# Altium project Sensor_Box_CAN_Shutter_CTRL.PrjPCB
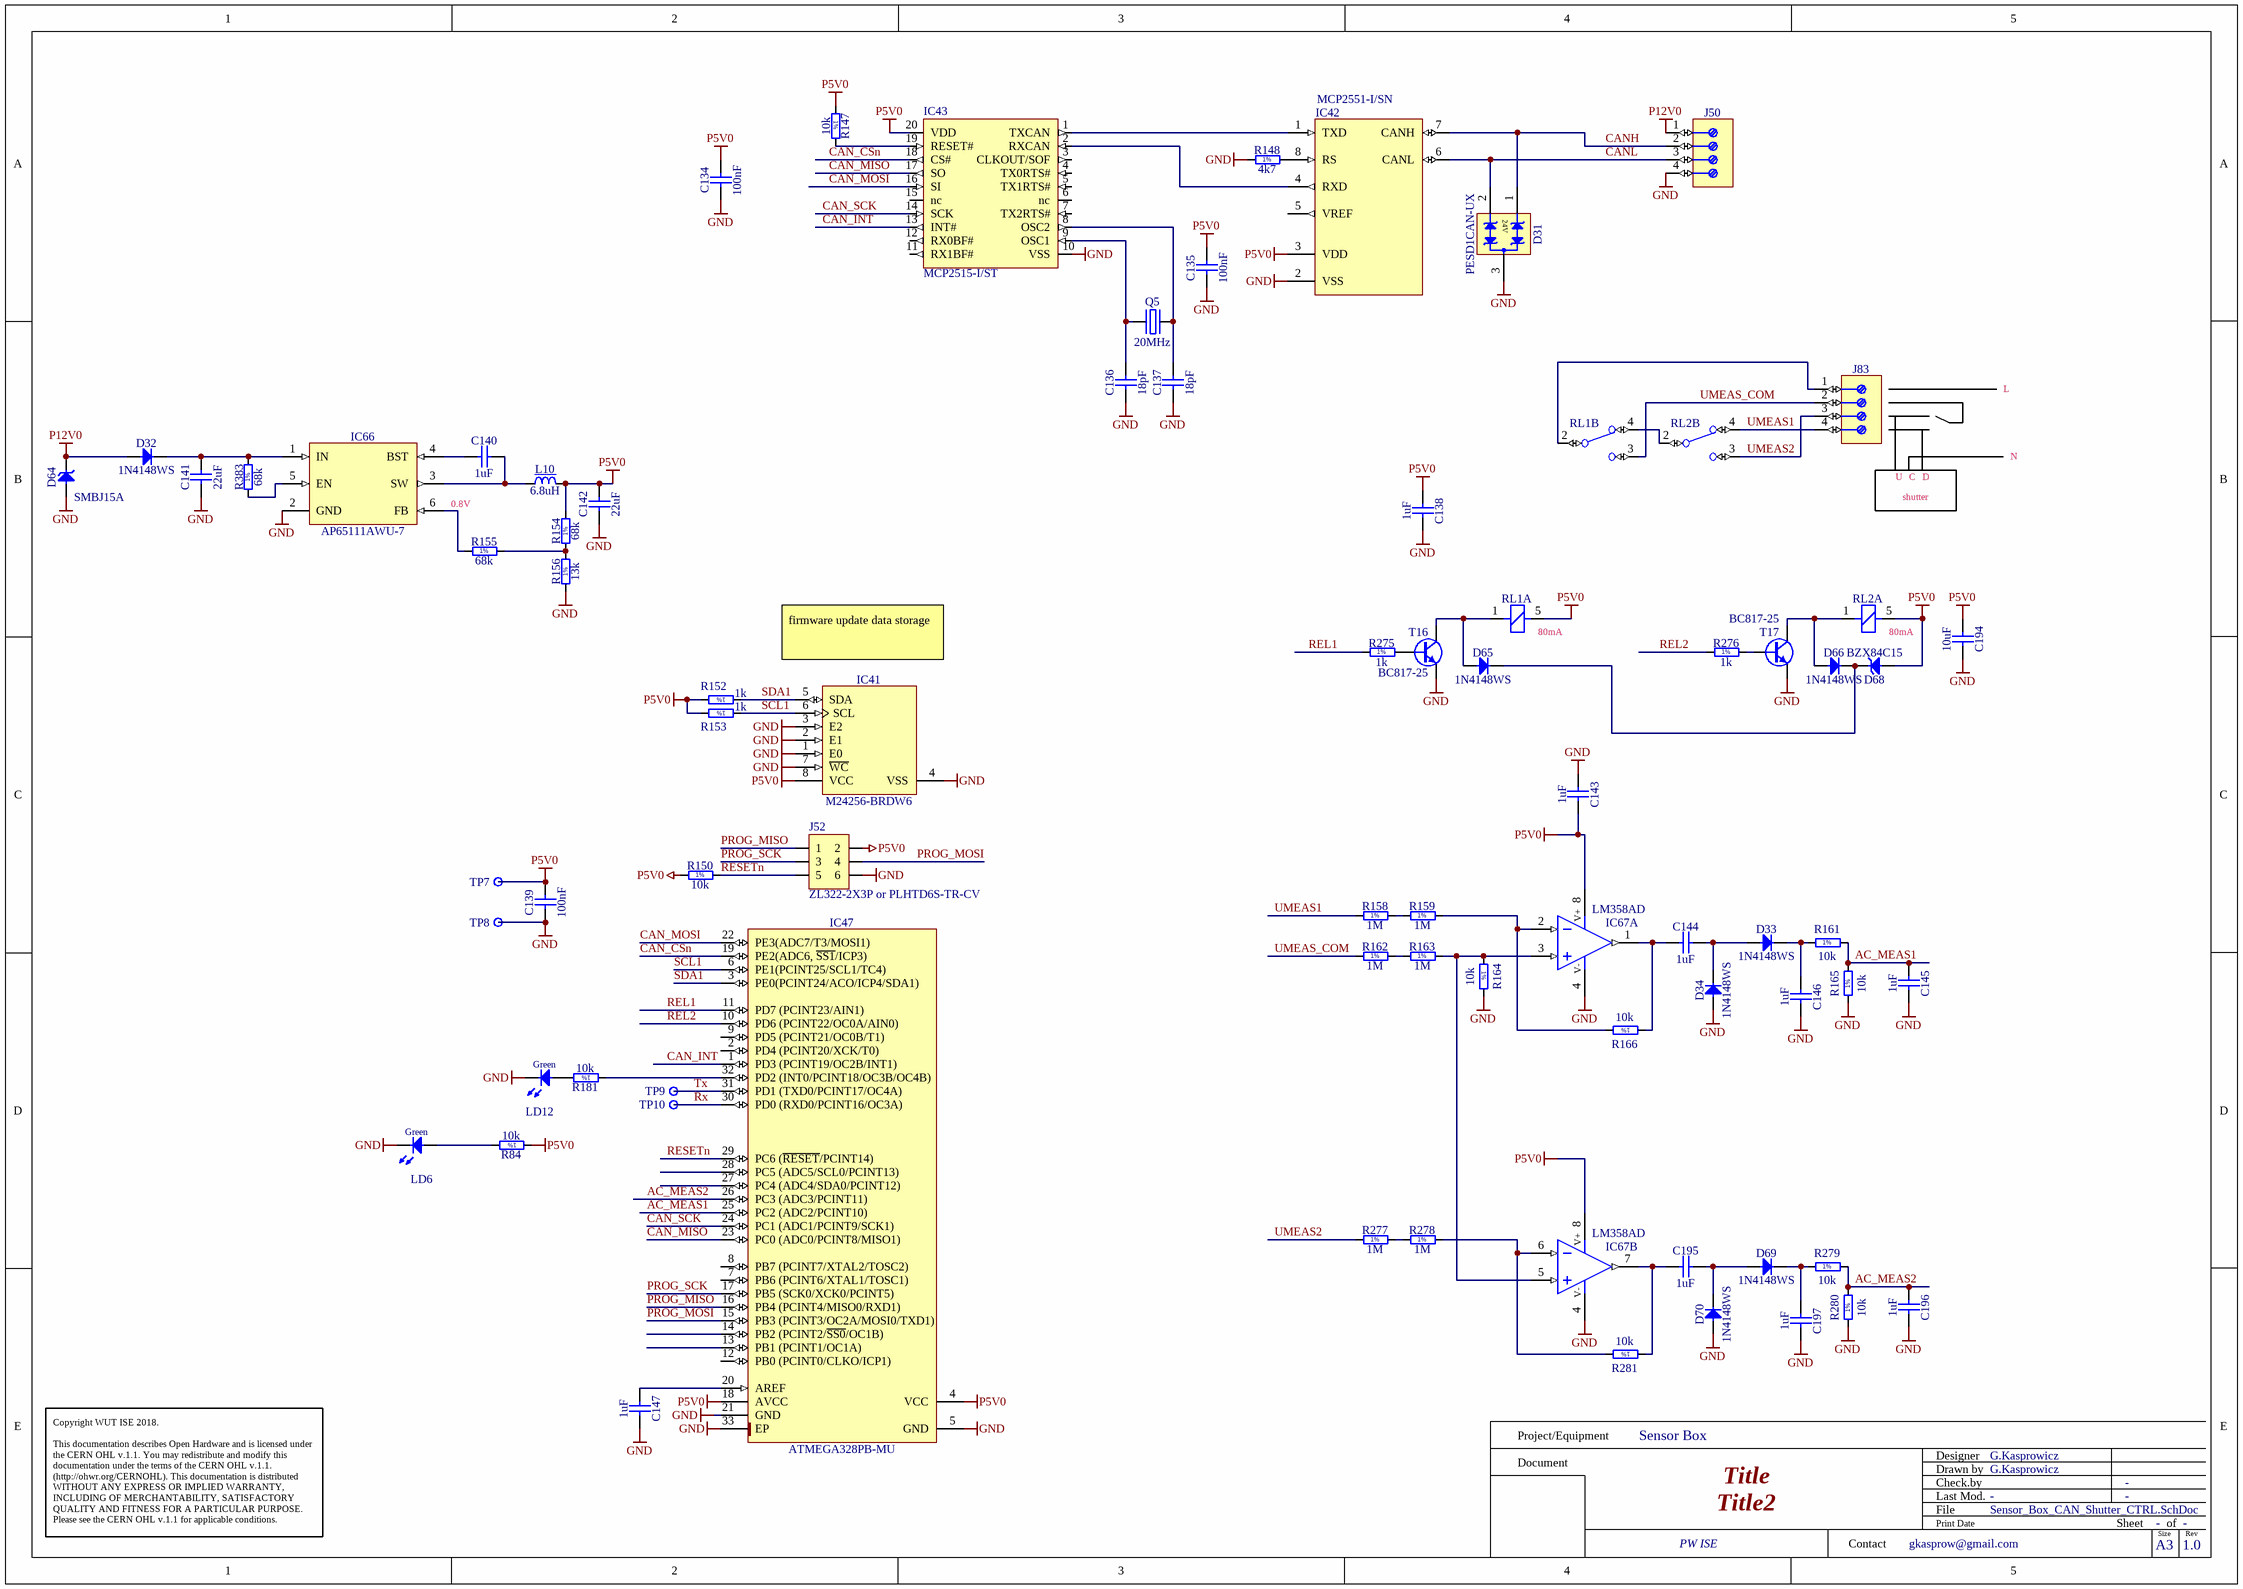
[diagram p0: Sensor_Box_CAN_Shutter_CTRL.SchDoc]
1 sheet, 75 parts. Net scope: global (net labels, ports and power ports of the same name join across sheets).
Board file: Sensor_Box_CAN_Shutter_CTRL.PCBDOC

## Sheet Sensor_Box_CAN_Shutter_CTRL.SchDoc: Title
size 420 x 297 mm; Author: G.Kasprowicz; CompanyName: WUT ISE; DrawnBy: G.Kasprowicz; Organization: WUT ISE; Address1: PW ISE; Address2: Nowowiejska 15/19 00-665 Warsaw; Address3: gkasprow@gmail.com; Revision: 1.0; SheetNumber: -; SheetTotal: -; ModifiedBy: -; CheckedDate: -; Title2: Title2; DivGrp: WUT ISE; Designer: G.Kasprowicz; ModifiedDate: -; ProjectName: Sensor Box

### Parts
C134  100nF  [CAPC1005X55N]
C135  100nF  [CAPC1005X55N]
C136  18pF  [CAPC1005X55N]
C137  18pF  [CAPC1005X55N]
C138  1uF  [CAPC1005X55N]
C139  100nF  [CAPC1005X55N]
C140  1uF  [CAPC1005X55N]
C141  22uF  [CAPC1709X100N]
C142  22uF  [CAPC1709X100N]
C143  1uF  [CAPC1005X55N]
C144  1uF  [CAPC1005X55N]
C145  1uF  [CAPC1005X55N]
C146  1uF  [CAPC1005X55N]
C147  1uF  [CAPC1005X55N]
C194  10uF  [CAPC2012X135N]
C195  1uF  [CAPC1005X55N]
C196  1uF  [CAPC1005X55N]
C197  1uF  [CAPC1005X55N]
D31  PESD1CAN-UX  [SOT95P237X112-3N]
D32  1N4148WS  [SODFL2512X100N]
D33  1N4148WS  [SODFL2512X100N]
D34  1N4148WS  [SODFL2512X100N]
D64  SMBJ15A  [DIOM5336X265N]
D65  1N4148WS  [SODFL2512X100N]
D66  1N4148WS  [SODFL2512X100N]
D68  BZX84C15  [SOT95P240X130-3N]
D69  1N4148WS  [SODFL2512X100N]
D70  1N4148WS  [SODFL2512X100N]
IC41  M24256-BRDW6  [SOP65P640X120-8N]
IC42  MCP2551-I/SN  [SOIC127P600X175-8N]
IC43  MCP2515-I/ST  [SOP65P640X110-20N]
IC47  ATMEGA328PB-MU  [QFN50P500X500X100-33N-S325]
IC66  AP65111AWU-7  [SOT95P280X100-6N]
IC67  LM358AD  [SOIC127P600X175-8N]  (parts A,B of 2)
J50  (no value)  [PHOENIX_1725672]
J52  ZL322-2X3P or PLHTD6S-TR-CV  [ZL322-2X3P]
J83  (no value)  [TYCO_282836-4]
L10  6.8uH  [IND_WALSIN_WLPN3030]
LD6  Green  [LED_KINGBRIGHT_KPH-1608CGCK]
LD12  Green  [LED_KINGBRIGHT_KPH-1608CGCK]
Q5  20MHz  [XTAL1160X490X430]
R84  10k  [RESC1005X40N]
R147  10k  [RESC1005X40N]
R148  4k7  [RESC1005X40N]
R150  10k  [RESC1005X40N]
R152  1k  [RESC1005X40N]
R153  1k  [RESC1005X40N]
R154  68k  [RESC1005X40N]
R155  68k  [RESC1005X40N]
R156  13k  [RESC1005X40N]
R158  1M  [RESC3216X65N]
R159  1M  [RESC3216X65N]
R161  10k  [RESC1005X40N]
R162  1M  [RESC3216X65N]
R163  1M  [RESC3216X65N]
R164  10k  [RESC1005X40N]
R165  10k  [RESC1005X40N]
R166  10k  [RESC1005X40N]
R181  10k  [RESC1005X40N]
R275  1k  [RESC1005X40N]
R276  1k  [RESC1005X40N]
R277  1M  [RESC3216X65N]
R278  1M  [RESC3216X65N]
R279  10k  [RESC1005X40N]
R280  10k  [RESC1005X40N]
R281  10k  [RESC1005X40N]
R383  68k  [RESC1005X40N]
RL1  REL_OMRON_G5Q-1  [REL_OMRON_G5Q-1]  (value not drawn)  (parts A,B of 2)
RL2  REL_OMRON_G5Q-1  [REL_OMRON_G5Q-1]  (value not drawn)  (parts A,B of 2)
T16  BC817-25  [SOT95P230X110-3N]
T17  BC817-25  [SOT95P230X110-3N]
TP7  Test Point  [TPS127]  (value not drawn)
TP8  Test Point  [TPS127]  (value not drawn)
TP9  Test Point  [TPS127]  (value not drawn)
TP10  Test Point  [TPS127]  (value not drawn)

### Nets
GND: C134.1 C135.1 C136.1 C137.1 C138.2 C139.1 C141.1 C142.1 C143.1 C145.2 C146.2 C147.2 C194.2 C196.2 C197.2 D31.3(GND) D34.2(A) D64.2(A) D70.2(A) IC41.1(E0) IC41.2(E1) IC41.3(E2) IC41.4(VSS) IC41.7(~{WC}) IC42.2(VSS) IC43.10(VSS) IC47.5(GND) IC47.21(GND) IC47.33(EP) IC66.2(GND) IC67.4(V-) J50.4 J52.6 LD6.1(C) LD12.1(C) R148.1 R156.1 R164.2 R165.1 R280.1 T16.2(E) T17.2(E) TP8.1
P5V0: C134.2 C135.2 C138.1 C139.2 C142.2 C143.2 C194.1 D68.1(A) IC41.8(VCC) IC42.3(VDD) IC43.20(VDD) IC47.4(VCC) IC47.18(AVCC) IC67.8(V+) J52.2 L10.2 R84.1 R147.1 R150.1 R152.2 R153.2 R154.2 RL1.5 RL2.5 TP7.1
P12V0: D32.2(A) D64.1(C) J50.1
AC_MEAS1: C145.1 IC47.25(PC2_(ADC2/PCINT10)) R161.2 R165.2
AC_MEAS2: C196.1 IC47.26(PC3_(ADC3/PCINT11)) R279.2 R280.2
CAN_CSn: IC43.18(CS#) IC47.19(PE2(ADC6,_~{SS1}/ICP3))
CAN_INT: IC43.13(INT#) IC47.1(PD3_(PCINT19/OC2B/INT1))
CAN_MISO: IC43.17(SO) IC47.23(PC0_(ADC0/PCINT8/MISO1))
CAN_MOSI: IC43.16(SI) IC47.22(PE3(ADC7/T3/MOSI1))
CAN_SCK: IC43.14(SCK) IC47.24(PC1_(ADC1/PCINT9/SCK1))
CANH: D31.1(I/O1) IC42.7(CANH) J50.2
CANL: D31.2(I/O2) IC42.6(CANL) J50.3
PROG_MISO: IC47.16(PB4_(PCINT4/MISO0/RXD1)) J52.1
PROG_MOSI: IC47.15(PB3_(PCINT3/OC2A/MOSI0/TXD1)) J52.4
PROG_SCK: IC47.17(PB5_(SCK0/XCK0/PCINT5)) J52.3
REL1: IC47.11(PD7_(PCINT23/AIN1)) R275.1
REL2: IC47.10(PD6_(PCINT22/OC0A/AIN0)) R276.1
RESETn: IC47.29(PC6_(~{RESET}/PCINT14)) J52.5 R150.2
Rx: IC47.30(PD0_(RXD0/PCINT16/OC3A)) TP10.1
SCL1: IC41.6(SCL) IC47.6(PE1(PCINT25/SCL1/TC4)) R153.1
SDA1: IC41.5(SDA) IC47.3(PE0(PCINT24/ACO/ICP4/SDA1)) R152.1
Tx: IC47.31(PD1_(TXD0/PCINT17/OC4A)) TP9.1
UMEAS1: J83.4 R158.1 RL2.4(NC)
UMEAS2: J83.3 R277.1 RL2.3(NO)
UMEAS_COM: J83.2 R162.1 RL1.3(NO)
NetC136_2: C136.2 IC43.9(OSC1) Q5.1(OSC1)
NetC137_2: C137.2 IC43.8(OSC2) Q5.2(OSC2)
NetC140_1: C140.1 IC66.4(BST)
NetC140_2: C140.2 IC66.3(SW) L10.1
NetC141_2: C141.2 D32.1(C) IC66.1(IN) R383.2
NetC144_1: C144.1 IC67.1(OUT) R166.1
NetC144_2: C144.2 D33.2(A) D34.1(C)
NetC146_1: C146.1 D33.1(C) R161.1
NetC147_1: C147.1 IC47.20(AREF)
NetC195_1: C195.1 IC67.7(OUT) R281.1
NetC195_2: C195.2 D69.2(A) D70.1(C)
NetC197_1: C197.1 D69.1(C) R279.1
NetD65_1: D65.1(C) D66.1(C) D68.3(C)
NetD65_2: D65.2(A) RL1.1 T16.3(C)
NetD66_2: D66.2(A) RL2.1 T17.3(C)
NetIC42_1: IC42.1(TXD) IC43.1(TXCAN)
NetIC42_4: IC42.4(RXD) IC43.2(RXCAN)
NetIC42_8: IC42.8(RS) R148.2
NetIC43_19: IC43.19(RESET#) R147.2
NetIC47_32: IC47.32(PD2_(INT0/PCINT18/OC3B/OC4B)) R181.1
NetIC66_5: IC66.5(EN) R383.1
NetIC66_6: IC66.6(FB) R155.1
NetIC67_2: IC67.2(IN-) R159.2 R166.2
NetIC67_3: IC67.3(IN+) IC67.5(IN+) R163.2 R164.1
NetIC67_6: IC67.6(IN-) R278.2 R281.2
NetJ83_1: J83.1 RL1.2(C)
NetLD6_2: LD6.2(A) R84.2
NetLD12_2: LD12.2(A) R181.2
NetR154_1: R154.1 R155.2 R156.2
NetR158_2: R158.2 R159.1
NetR162_2: R162.2 R163.1
NetR275_2: R275.2 T16.1(B)
NetR276_2: R276.2 T17.1(B)
NetR277_2: R277.2 R278.1
NetRL1_4: RL1.4(NC) RL2.2(C)

Not connected (* = marked no-connect by the designer): IC42 5(VREF); IC43 3(CLKOUT/SOF) 4(TX0RTS#) 5(TX1RTS#) 6(nc) 7(TX2RTS#) 11(RX1BF#) 12(RX0BF#) 15(nc); IC47 2(PD4_(PCINT20/XCK/T0)) 7(PB6_(PCINT6/XTAL1/TOSC1)) 8(PB7_(PCINT7/XTAL2/TOSC2)) 9(PD5_(PCINT21/OC0B/T1)) 12(PB0_(PCINT0/CLKO/ICP1)) 13(PB1_(PCINT1/OC1A)) 14(PB2_(PCINT2/~{SS0}/OC1B)) 27(PC4_(ADC4/SDA0/PCINT12)) 28(PC5_(ADC5/SCL0/PCINT13))

### Notes on the sheet
- L
- N
- 0.8V
- U
- shutter
- C
- D
- firmware update data storage
- (near RL1) 80mA
- (near RL2) 80mA
- Project/Equipment
- Document
- Designer
- Drawn by
- Check.by
- Copyright WUT ISE 2018.
  This documentation describes Open Hardware and is licensed under the CERN OHL v.1.1. You may redistribute and modify this documentation under the terms of the CERN OHL v.1.1. (http://ohwr.org/CERNOHL). This documentation is distributed WITHOUT ANY EXPRESS OR IMPLIED WARRANTY, INCLUDING OF MERCHANTABILITY, SATISFACTORY QUALITY AND FITNESS FOR A PARTICULAR PURPOSE. Please see the CERN OHL v.1.1 for applicable conditions.
- Contact
- File
- Last Mod.
- Print Date
- Sheet
- Size
- A3
- of
- Rev
- (in symbol R0402_1K_1%_0.0625W_100PPM) 1%
- (in symbol R0402_4K7_1%_0.0625W_100PPM) 1%
- (in symbol R0402_10K_1%_0.0625W_100PPM) 1%
- (in symbol R0402_13K_1%_0.0625W_100PPM) 1%
- (in symbol R0402_68K_1%_0.0625W_100PPM) 1%
- (in symbol R1206_1M_1%_0.25W_100PPM) 1%

### Library data of the parts
C134 C135 C139 = CC0402_100NF_16V_10%_X5R: Non-polarised capacitor; Part Description: SMD Multilayer Chip Ceramic Capacitor; Manufacturer: GENERIC; Manufacturer1 Part Number: GRM155R61C104KA88D; Voltage: 16V; TC: X5R; Tolerance: ±10%; Part Number: CC0402_100NF_16V_10%_X5R; Component Kind: Standard; Component Type: Standard; Pin Count: 2; Value: 100nF; Status: None; Manufacturer Part Number: CC0402_100NF_16V_10%_X5R; Case: 0402; Mounted: Yes; Socket: No; SMD: Yes; Sense: No; Manufacturer1 Example: MURATA; Manufacturer1 ComponentHeight: 0.55mm; HelpURL: \\cern.ch\dfs\Applications\Altium\Datasheets\CC0402_X5R_MURATA_GRM.pdf; Author: CERN DEM JLC; CreateDate: 10.12.2013; LatestRevisionDate: 10.12.2013
C136 C137 = CC0402_18PF_50V_5%_C0G: Non-polarised capacitor; Part Description: SMD Multilayer Chip Ceramic Capacitor; Manufacturer: GENERIC; Manufacturer1 Part Number: C0402C180J5GACTU; Voltage: 50V; TC: C0G/NP0; Tolerance: ±5%; Part Number: CC0402_18PF_50V_5%_C0G; Component Kind: Standard; Component Type: Standard; Pin Count: 2; Value: 18pF; Status: Preferred; Manufacturer Part Number: CC0402_18PF_50V_5%_C0G; Case: 0402; Mounted: Yes; Socket: No; SMD: Yes; Sense: No; Manufacturer1 Example: KEMET; Manufacturer1 ComponentHeight: 0.55mm; HelpURL: \\cern.ch\dfs\Applications\Altium\Datasheets\CC0805_C0G_KEMET_(Commercial Grade).pdf; Author: CERN DEM JLC; CreateDate: 04.10.2016; LatestRevisionDate: 04.10.2016
C138 C140 C143-C147 C195-C197 = CC0402_1UF_16V_10%_X5R: Non-polarised capacitor; Part Description: SMD Multilayer Chip Ceramic Capacitor; Manufacturer: GENERIC; Manufacturer1 Part Number: C1005X5R1C105KT; Voltage: 16V; TC: X5R; Tolerance: ±10%; Part Number: CC0402_1UF_16V_10%_X5R; Component Kind: Standard; Component Type: Standard; Pin Count: 2; Value: 1uF; Status: Preferred; Manufacturer Part Number: CC0402_1UF_16V_10%_X5R; Case: 0402; Mounted: Yes; Socket: No; SMD: Yes; Sense: No; Manufacturer1 Example: TDK; Manufacturer1 ComponentHeight: 0.55mm; HelpURL: \\cern.ch\dfs\Applications\Altium\Datasheets\CC0402_X5R_TDK_C.pdf; Author: CERN DEM JLC; CreateDate: 25.10.2012; LatestRevisionDate: 25.10.2012
C141 C142 = CC0603_22UF_6.3V_20%_X5R: Non-polarised capacitor; Part Description: SMD Multilayer Chip Ceramic Capacitor; Manufacturer: GENERIC; Manufacturer1 Part Number: C1608X5R0J226M080AC; Voltage: 6.3V; TC: X5R; Tolerance: ±20%; Part Number: CC0603_22UF_6.3V_20%_X5R; Component Kind: Standard; Component Type: Standard; Pin Count: 2; Value: 22uF; Status: None; Manufacturer Part Number: CC0603_22UF_6.3V_20%_X5R; Case: 0603; Mounted: Yes; Socket: No; SMD: Yes; Sense: No; Manufacturer1 Example: TDK; Manufacturer1 ComponentHeight: 1mm; HelpURL: \\cern.ch\dfs\Applications\Altium\Datasheets\CC0603_X5R_TDK_C.pdf; Author: CERN DEM JLC; CreateDate: 16.12.2013; LatestRevisionDate: 13.09.2016
C194 = CC0805_10UF_16V_10%_X5R: Non-polarised capacitor; Part Description: SMD Multilayer Chip Ceramic Capacitor; Manufacturer: GENERIC; Manufacturer1 Part Number: C0805C106K4PAC; Voltage: 16V; TC: X5R; Tolerance: ±10%; Part Number: CC0805_10UF_16V_10%_X5R; Component Kind: Standard; Component Type: Standard; Pin Count: 2; Value: 10uF; Status: Preferred; Manufacturer Part Number: CC0805_10UF_16V_10%_X5R; Case: 0805; Mounted: Yes; Socket: No; SMD: Yes; Manufacturer1 Example: KEMET; Manufacturer1 ComponentHeight: 1.4mm; HelpURL: \\cern.ch\dfs\Applications\Altium\Datasheets\CC1206_X5R_KEMET.pdf; Author: CERN DEM JLC; CreateDate: 03.12.2007; LatestRevisionDate: 03.12.2007; Sense: No
D31 = D_TVS_PESD1CAN: TVS Diode for CAN; Manufacturer: Nexperia; Voltage: 24V; Power: 400W; PressFit: No; Bonding: No; Part Number: PESD1CAN-UX; Component Kind: Standard; Component Type: Standard; Device: PESD1CAN-UX; PackageDescription: SOT, 0.95mm, pitch; 3 pin,1.30mm W X 2.92mm L X 1.12mm H body, IPC Medium Density; Part Description: TVS Diode for CAN; Manufacturer Part Number: PESD1CAN-UX; Pin Count: 3; Case: SOT-23; Mounted: Yes; Socket: No; SMD: Yes; Sense: No; ComponentHeight: 1.12mm; HelpURL: \\cern.ch\dfs\Applications\Altium\Datasheets\SM712.TCT.pdf; Author: CERN DEM JLC; CreateDate: 03.09.2014; LatestRevisionDate: 13.01.2015
D32-D34 D65 D66 D69 D70 = 1N4148WS: Diode; Part Description: Small Signal Diodes; Manufacturer: FAIRCHILD SEMICONDUCTOR; Voltage: 75V; Power: 150mA; PressFit: No; Bonding: No; Part Number: 1N4148WS; Component Kind: Standard; Component Type: Standard; Device: 1N4148WS; PackageDescription: SODFL Diode; 1.70mm W X 1.25mm L X 1.00mm H body, IPC Medium Density; Manufacturer Part Number: 1N4148WS; Pin Count: 2; Case: SOD-323F; Mounted: Yes; Socket: No; SMD: Yes; Sense: No; ComponentHeight: 1mm; HelpURL: \\cern.ch\dfs\Applications\Altium\Datasheets\1N4148WS.pdf; Author: CERN DEM JLC; CreateDate: 12.05.2011; LatestRevisionDate: 12.05.2011
D64 = SMBJ15A: Zener Diode; Part Description: Uni-Directional Transient Voltage Suppressor Diode; Manufacturer: FAIRCHILD SEMICONDUCTOR; Voltage: 15V; Power: 600W; PressFit: No; Bonding: No; Part Number: SMBJ15A; Component Kind: Standard; Component Type: Standard; Device: SMBJ15A; PackageDescription: DO-214-AA/SMB Diode, Molded Body; 5.34mm L X 3.625mm W X 2.65mm H, IPC Medium Density; Manufacturer Part Number: SMBJ15A; Pin Count: 2; Case: DO-214AA; Mounted: Yes; Socket: No; SMD: Yes; Sense: No; ComponentHeight: 2.65mm; HelpURL: \\cern.ch\dfs\Applications\Altium\Datasheets\SMBJ.pdf; Author: CERN DEM JLC; CreateDate: 08.12.2008; LatestRevisionDate: 19.12.2011
D68 = BZX84C15: Diode Zener Anode Pin 1 Cathode Pin 3 (Pas de pin 2); Part Description: Zener Diode; Manufacturer: FAIRCHILD SEMICONDUCTOR; Voltage: 15V; Power: 350mW; PressFit: No; Bonding: No; Part Number: BZX84C15; Component Kind: Standard; Component Type: Standard; Device: BZX84C15; PackageDescription: SOT23 3-Leads, Pitch 0.95mm - Body 1.3x2.9mm, IPC Medium Density; Manufacturer Part Number: BZX84C15; Pin Count: 3; Case: SOT23-3; Mounted: Yes; Socket: No; SMD: Yes; Sense: No; ComponentHeight: 1.3mm; HelpURL: \\cern.ch\dfs\Applications\Altium\Datasheets\BZX84C15.pdf; Author: CERN DEM JLC; CreateDate: 30.11.2011; LatestRevisionDate: 30.11.2011
IC41 = MEM_M24256-BRDW6P: 256-Kbit Serial I²C Bus EEPROM; Manufacturer: ST MICROELECTRONICS; PressFit: No; Bonding: No; Part Number: M24256-BRDW6P; Component Kind: Standard; Component Type: Standard; Device: M24256-BRDW6; PackageDescription: SOP, 0.65mm pitch; 8 pin, 4.40mm W X 3.00mm L X 1.20mm H body, IPC Medium Density; Part Description: 256-Kbit Serial I²C Bus EEPROM; Manufacturer Part Number: M24256-BRDW6; Pin Count: 8; Case: TSSOP8; Mounted: Yes; Socket: No; SMD: Yes; Sense: No; ComponentHeight: 1.2mm; HelpURL: \\cern.ch\dfs\Applications\Altium\Datasheets\M24256-BRDW6P.pdf; Author: CERN DEM MR; CreateDate: 17.03.2016; LatestRevisionDate: 17.03.2016
IC42 = IFC_MCP2551: High-Speed CAN Transceiver, 8-Pin SOIC, Industrial Temperature; Manufacturer: MICROCHIP TECHNOLOGY; PressFit: No; Bonding: No; Part Number: MCP2551-I/SN; Component Kind: Standard; Component Type: Standard; Device: MCP2551-I/SN; PackageDescription: SOIC 8, Pitch 1.27mm - Body 4x5mm, IPC Medium Density; Part Description: High-Speed CAN Transceiver; Manufacturer Part Number: MCP2551-I/SN; Pin Count: 8; Case: SOIC8; Mounted: Yes; Socket: No; SMD: Yes; Sense: No; ComponentHeight: 1.75mm; Author: GK; CreateDate: 07.09.2016; LatestRevisionDate: 07.09.2016
IC43 = IFC_MCP2515_TSSOP: CAN Controller With SPI nterface; Manufacturer: Microchip; Manufacturer Part Number: MCP2515T-I/ST; Part Description: Stand-Alone CAN Controller with SPI Interface; Case: TSSOP20; Component Type: Standard; Device: MCP2515; Mounted: Yes; PackageDescription: TSSOP 20, Pitch 0.65mm - Body 4.5x6.5mm, IPC Medium Density; Part Number: MCP2515T-I/ST; Pin Count: 20; SMD: Yes
IC47 = UPC_ATMEGA328PB-MU: 8-bit AVR 20MHz Microcontroller With 32K Bytes In-System  Programmable  Flash; Part Description: 8-bit AVR Microcontroller, 32KB Flash, 1KB EEPROM, 2KB SRAM, 32-pin MLF, Industrial Grade (-40°C to 85°C); Manufacturer: ATMEL; PressFit: No; Bonding: No; Part Number: ATMEGA328PB-MU; Component Kind: Standard; Component Type: Standard; Device: ATMEGA328PB-MU; PackageDescription: QFN, (MO-220-VHHD-2) 0.50mm pitch,square; 8 pin X 8 pin, 5mm X 5mm X 1.00mm H body (w/thermal tab 3.25 X 3.25mm),  IPC Medium Density; Manufacturer Part Number: ATMEGA328PB-MU; Pin Count: 33; Case: QFN32; Mounted: Yes; Socket: No; SMD: Yes; Sense: No; ComponentHeight: 1mm; HelpURL: \\cern.ch\dfs\Applications\Altium\Datasheets\ATMEGA328P-MU.pdf; Author: GK; CreateDate: 2011-02-08; LatestRevisionDate: 2014-07-02
IC66 = AP65111AWU-7: Light Load Improved 1.5A Synch DC/DC Buck Converter; Manufacturer: DIODES INCORPORATED; PressFit: No; Bonding: No; Part Number: AP65111AWU-7; Component Kind: Standard; Component Type: Standard; Device: AP65111AWU-7; PackageDescription: SOT23, 0.95mm pitch; 6 pin, 1.625mm W X 2.90mm L X 1.00mm H body, IPC Medium Density; Part Description: Light Load Improved 1.5A Synch DC/DC Buck Converter; Manufacturer Part Number: AP65111AWU-7; Pin Count: 6; Case: SOT23-6; Mounted: Yes; Socket: No; SMD: Yes; Sense: No; ComponentHeight: 1.1mm; HelpURL: \\cern.ch\dfs\Applications\Altium\Datasheets\AP65111AWU-7.pdf; Author: CERN DEM JLC; CreateDate: 20.03.2018; LatestRevisionDate: 20.03.2018
IC67 = LM358AD: Dual Operational Amplifier; Manufacturer: TEXAS INSTRUMENTS; PressFit: No; Bonding: No; Part Number: LM358AD; Component Kind: Standard; Component Type: Standard; Device: LM358AD; PackageDescription: SOIC 8, Pitch 1.27mm - Body 4x5mm, IPC Medium Density; Part Description: Dual Operational Amplifier; Manufacturer Part Number: LM358AD; Pin Count: 8; Case: SOIC8; Mounted: Yes; Socket: No; SMD: Yes; Sense: No; ComponentHeight: 1.75mm; Author: CERN DEM JLC; HelpURL: \\cern.ch\dfs\Applications\Altium\Datasheets\LM358AD.pdf; CreateDate: 02.12.2008; LatestRevisionDate: 13.04.2010
J50 = PHOENIX_1725672: Terminal Block, 4 Positions, Screw Connection; Part Description: 6A, 63V, Terminal Block, Pitch 2.54mm, 4 Positions, Screw Connection; Manufacturer: PHOENIX CONTACT; Manufacturer Part Number: 1725672 (MPT 0,5/4-2,54); PressFit: No; Part Number: PHOENIX_1725672; Component Kind: Standard; Component Type: Standard; Pin Count: 4; Mounted: Yes; Socket: No; SMD: No; Sense: No; Status: None; ComponentHeight: 8.5mm; HelpURL: \\cern.ch\dfs\Applications\Altium\Datasheets\PHOENIX_1725672.pdf; Author: CERN DEM JMW; CreateDate: 07.11.2008; LatestRevisionDate: 26.04.2010
J52 = CON_2x3 1.27 SMT Male: 1.27 mm dual row goldpin (Maritex)
J83 = TYCO_282836-4: Terminal Block, 4 Positions, Screw Connection; Part Description: 15.5A, 300V, Terminal Block, Pitch 5mm, 4 Positions, Screw Connection; Manufacturer: TYCO ELECTRONICS; PressFit: No; Part Number: TYCO_282836-4; Component Kind: Standard; Component Type: Standard; Pin Count: 4; Mounted: Yes; Socket: No; SMD: No; Sense: No; Status: None; Manufacturer Part Number: 282836-4; ComponentHeight: 10mm; HelpURL: \\cern.ch\dfs\Applications\Altium\Datasheets\TYCO_282836-4.pdf; Author: CERN DEM JLC; CreateDate: 10.11.2014; LatestRevisionDate: 10.11.2014
L10 = IND_WLPN3030: 6,8uH; 900mA; 0,211Ω; 3x3x1,5mm; Part Number: IND_6.8UH_20%_WALSIN_WLPN303015M6R8PB; Part Description: Miniature Surface Mount Power Inductor (8200 Series); Manufacturer: WALSIN; Manufacturer Part Number: WLPN303015M6R8PB; Resistance: 0.21R; Tolerance: ±20%; Component Kind: Standard; Component Type: Standard; Pin Count: 2; Value: 6.8uH; Status: None; Power: 900mA; Mounted: Yes; Socket: No; SMD: Yes; Sense: No; ComponentHeight: 1.5; HelpURL: \\cern.ch\dfs\Applications\Altium\Datasheets\IND_MURATA-PS_8200.pdf; Author: GK; CreateDate: 11.07.2016; LatestRevisionDate: 11.07.2016
LD6 LD12 = LED_KINGBRIGHT_KPH-1608CGCK: LED Green 1C 2A; Part Description: SMD Green LED, Case 1.6mmX0.8mm(0603), 0.65mm Thickness; PressFit: No; Bonding: No; Part Number: LED_KINGBRIGHT_KPH-1608CGCK; Component Kind: Standard; Component Type: Standard; Color: Green; PackageDescription: SMT Green LED, Case 0603, Body L 1.6 x W 0.8mm H 0.65mm; Manufacturer: KINGBRIGHT; Manufacturer Part Number: KPH-1608CGCK; Pin Count: 2; Mounted: Yes; Socket: No; SMD: Yes; Sense: No; ComponentHeight: 0.65mm; HelpURL: \\cern.ch\dfs\Applications\Altium\Datasheets\LED_KINGBRIGHT_KPH-1608CGCK.pdf; Author: CERN DEM JLC; CreateDate: 03.07.2017; LatestRevisionDate: 03.07.2017
Q5 = X_CRYSTAL_20M_HC49: Quartz Crystal 20MHz, 30ppm, 20pF; Part Number: SR PASSIVES 20M-49SMD-SR; Part Description: Tolerance:± 30ppm, Stability:± 50ppm, -10°C to +60°C, 20pF, Surface Mount Quartz Crystal, HC49/4HSMX Series; Manufacturer: SR PASSIVES; Manufacturer Part Number: 20M-49SMD-SR; PressFit: No; Bonding: No; Component Kind: Standard; Component Type: Standard; PackageDescription: HC49/4H SMX Case, SMD Cristal, Body 11.6x4.9mm; Value: 20MHz; Pin Count: 2; Mounted: Yes; Socket: No; SMD: Yes; Sense: No; ComponentHeight: 4.3mm; HelpURL: \\cern.ch\dfs\Applications\Altium\Datasheets\XTAL_IQD_LFXTAL003166.pdf; Author: GK; CreateDate: 19.04.2012; LatestRevisionDate: 07.11.2016
R84 R147 R150 R181 = R0402_10K_1%_0.0625W_100PPM: Resistor - 1%; Part Description: General Purpose Thick Film Chip Resistor; Manufacturer: GENERIC; Manufacturer1 Part Number: 232270671003L; TC: ±100ppm/°C; PressFit: No; Part Number: R0402_10K_1%_0.0625W_100PPM; Component Kind: Standard; Component Type: Standard; Pin Count: 2; Value: 10k; Status: Not Recommended; Power: 0.0625W; Tolerance: ±1%; Manufacturer Part Number: R0402_10K_1%_0.0625W_100PPM; Case: 0402; Mounted: Yes; Sense: No; Socket: No; SMD: Yes; Manufacturer1 Example: YAGEO PHYCOMP; Manufacturer1 ComponentHeight: 0.4mm; HelpURL: \\cern.ch\dfs\Applications\Altium\Datasheets\R0402_Phycomp_RC0402.pdf; Author: CERN DEM JLC; CreateDate: 03.12.2007; LatestRevisionDate: 17.10.2012
R148 = R0402_4K7_1%_0.0625W_100PPM: Resistor - 1%; Part Description: General Purpose Thick Film Chip Resistor; Manufacturer: GENERIC; Manufacturer1 Part Number: 232270674702L; TC: ±100ppm/°C; PressFit: No; Part Number: R0402_4K7_1%_0.0625W_100PPM; Component Kind: Standard; Component Type: Standard; Pin Count: 2; Value: 4k7; Status: Not Recommended; Power: 0.0625W; Tolerance: ±1%; Manufacturer Part Number: R0402_4K7_1%_0.0625W_100PPM; Case: 0402; Mounted: Yes; Sense: No; Socket: No; SMD: Yes; Manufacturer1 Example: YAGEO PHYCOMP; Manufacturer1 ComponentHeight: 0.4mm; HelpURL: \\cern.ch\dfs\Applications\Altium\Datasheets\R0402_Phycomp_RC0402.pdf; Author: CERN DEM JLC; CreateDate: 03.12.2007; LatestRevisionDate: 17.10.2012
R152 R153 R275 R276 = R0402_1K_1%_0.0625W_100PPM: Resistor - 1%; Part Description: General Purpose Thick Film Chip Resistor; Manufacturer: GENERIC; Manufacturer1 Part Number: 232270671002L; TC: ±100ppm/°C; PressFit: No; Part Number: R0402_1K_1%_0.0625W_100PPM; Component Kind: Standard; Component Type: Standard; Pin Count: 2; Value: 1k; Status: Not Recommended; Power: 0.0625W; Tolerance: ±1%; Manufacturer Part Number: R0402_1K_1%_0.0625W_100PPM; Case: 0402; Mounted: Yes; Sense: No; Socket: No; SMD: Yes; Manufacturer1 Example: YAGEO PHYCOMP; Manufacturer1 ComponentHeight: 0.4mm; HelpURL: \\cern.ch\dfs\Applications\Altium\Datasheets\R0402_Phycomp_RC0402.pdf; Author: CERN DEM JLC; CreateDate: 03.12.2007; LatestRevisionDate: 17.10.2012
R154 R155 R383 = R0402_68K_1%_0.0625W_100PPM: Resistor - 1%; Part Description: General Purpose Thick Film Chip Resistor; Manufacturer: GENERIC; Manufacturer1 Part Number: 232270676803L; TC: ±100ppm/°C; PressFit: No; Part Number: R0402_68K_1%_0.0625W_100PPM; Component Kind: Standard; Component Type: Standard; Pin Count: 2; Value: 68k; Status: Not Recommended; Power: 0.0625W; Tolerance: ±1%; Manufacturer Part Number: R0402_68K_1%_0.0625W_100PPM; Case: 0402; Mounted: Yes; Sense: No; Socket: No; SMD: Yes; Manufacturer1 Example: YAGEO PHYCOMP; Manufacturer1 ComponentHeight: 0.4mm; HelpURL: \\cern.ch\dfs\Applications\Altium\Datasheets\R0402_Phycomp_RC0402.pdf; Author: CERN DEM JLC; CreateDate: 03.12.2007; LatestRevisionDate: 17.10.2012
R156 = R0402_13K_1%_0.0625W_100PPM: Resistor - 1%; Part Description: General Purpose Thick Film Chip Resistor; Manufacturer: GENERIC; Manufacturer1 Part Number: 232270671303L; TC: ±100ppm/°C; PressFit: No; Part Number: R0402_13K_1%_0.0625W_100PPM; Component Kind: Standard; Component Type: Standard; Pin Count: 2; Value: 13k; Status: Not Recommended; Power: 0.0625W; Tolerance: ±1%; Manufacturer Part Number: R0402_13K_1%_0.0625W_100PPM; Case: 0402; Mounted: Yes; Sense: No; Socket: No; SMD: Yes; Manufacturer1 Example: YAGEO PHYCOMP; Manufacturer1 ComponentHeight: 0.4mm; HelpURL: \\cern.ch\dfs\Applications\Altium\Datasheets\R0402_Phycomp_RC0402.pdf; Author: CERN DEM JLC; CreateDate: 03.12.2007; LatestRevisionDate: 17.10.2012
R158 R159 R162 R163 R277 R278 = R1206_1M_1%_0.25W_100PPM: Resistor - 1%; Part Description: General Purpose Thick Film Chip Resistor; Manufacturer: GENERIC; Manufacturer1 Part Number: NRC12F1004TRF; Power: 0.25W; TC: ±100ppm/°C; PressFit: No; Part Number: R1206_1M_1%_0.25W_100PPM; Component Kind: Standard; Component Type: Standard; Pin Count: 2; Value: 1M; Status: Preferred; Tolerance: ±1%; Manufacturer Part Number: R1206_1M_1%_0.25W_100PPM; Case: 1206; Mounted: Yes; Sense: No; Socket: No; SMD: Yes; Manufacturer1 Example: NIC COMPONENT; Manufacturer1 ComponentHeight: 0.65mm; HelpURL: \\cern.ch\dfs\Applications\Altium\Datasheets\R1206_NIC_NRC.pdf; Author: CERN DEM JLC; CreateDate: 03.12.2007; LatestRevisionDate: 13.03.2008
R161 R164-R166 R279-R281 = R0402_10K_1%_0.0625W_100PPM: Resistor - 1%; Part Description: General Purpose Thick Film Chip Resistor; Manufacturer: GENERIC; Manufacturer1 Part Number: 232270671003L; TC: ±100ppm/°C; Table: Resistors SMD; Part Number: R0402_10K_1%_0.0625W_100PPM; Component Kind: Standard; Component Type: Standard; Pin Count: 2; Value: 10k; Status: Not recommended; Power: 0.0625W; Tolerance: ±1%; Manufacturer Part Number: R0402_10K_1%_0.0625W_100PPM; Case: 0402; Mounted: Yes; Socket: No; SMD: Yes; Manufacturer1 Example: YAGEO PHYCOMP; Manufacturer1 ComponentHeight: 0.4mm; HelpURL: \\cern.ch\dfs\Applications\Altium\Datasheets\R0402_Phycomp_RC0402.pdf; Author: CERN DEM JLC; CreateDate: 2007-12-03; LatestRevisionDate: 2012-10-17
RL1 RL2 = REL_OMRON_G5Q-1-5VDC: SPDT, Power Relay, 10A Switching Capacity, G5Q-1 Series; Manufacturer: OMRON ELECTRONIC; Manufacturer Part Number: G5Q-1-DC5; PressFit: No; Value: 5VDC; Part Number: REL_OMRON_G5Q-1-5VDC; Component Kind: Standard; Component Type: Standard; Pin Count: 5; PackageDescription: 5 Leads, Row Spacing 7.62mm; Body 20.3mm x 10.3mm, OMRON_G5Q-1 Series; Mounted: Yes; Socket: No; SMD: No; Sense: No; Status: None; Part Description: SPDT, Power Relay, 10A Switching Capacity, G5Q-1 Series; ComponentHeight: 15.8mm; HelpURL: \\cern.ch\dfs\Applications\Altium\Datasheets\REL_OMRON_G5Q-1.pdf; Author: CERN DEM MR; CreateDate: 09.06.2016; LatestRevisionDate: 09.06.2016
T16 T17 = BC817-25: NPN Transistor; Part Description: 45V 500mA NPN General-Purpose Transistor; Manufacturer: NXP SEMICONDUCTORS; PressFit: No; Bonding: No; Part Number: BC817-25; Component Kind: Standard; Component Type: Standard; Device: BC817-25; PackageDescription: SOT23, 3 pin, Pitch 0.95mm - 1.3mm W X 2.9mm L X 1.1mm H, IPC Medium Density; Manufacturer Part Number: BC817-25; Pin Count: 3; Case: SOT23-3; Mounted: Yes; Socket: No; SMD: Yes; Sense: No; ComponentHeight: 1.1mm; HelpURL: \\cern.ch\dfs\Applications\Altium\Datasheets\BC817-25.pdf; Author: CERN DEM JLC; CreateDate: 28.10.2014; LatestRevisionDate: 28.10.2014
TP7-TP10 = SMD_PAD_1.27X1.27MM: Part Description: 1.27mm x 1.27mm PCB Copper Area (SMD Test Point); Mounted: No; Part Number: SMD_PAD_1.27X1.27MM; Component Kind: Standard (No BOM); Component Type: Standard (No BOM); Pin Count: 1; Family: Test Point; Socket: No; SMD: Yes; Sense: No; Status: None; ComponentHeight: 0mm; HelpURL: Undefined; Author: CERN DEM JLC; CreateDate: 12.01.2008; LatestRevisionDate: 12.01.2008; PackageDescription: 1.27mm x 1.27mm PCB Copper Area (SMD Test Point)